# Altium project Master.PrjPcb
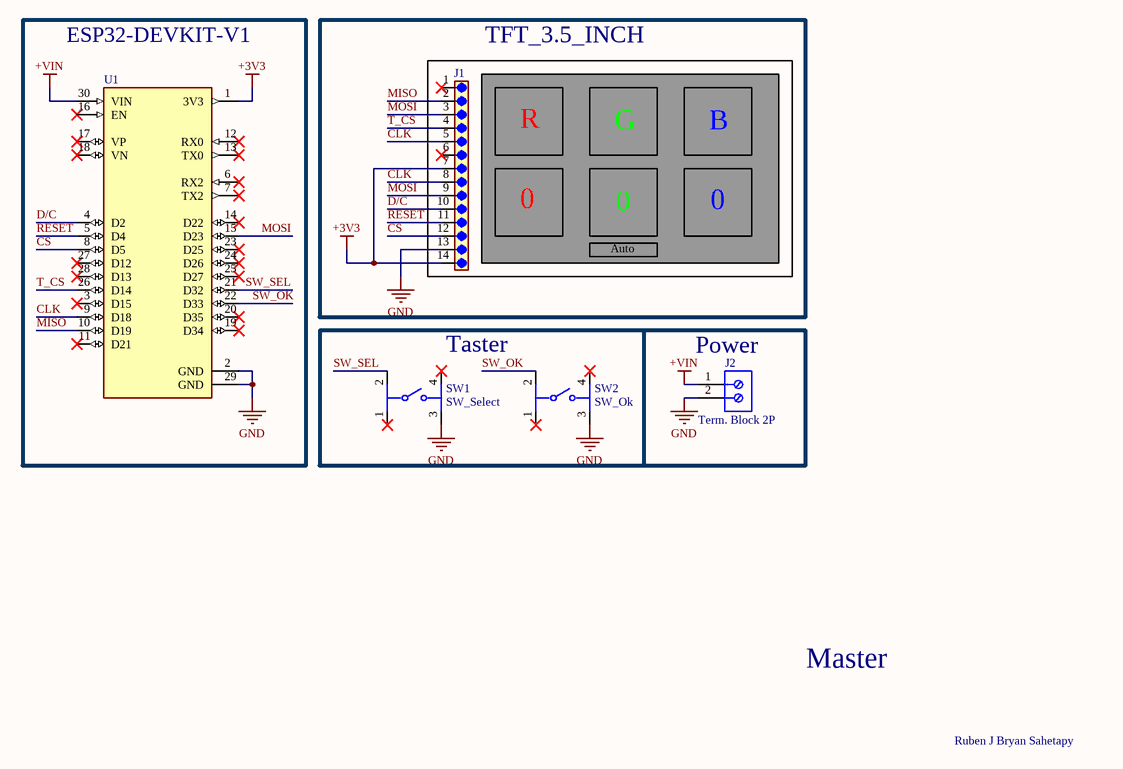
[diagram p0: SCH_Master.SchDoc]
1 sheet, 5 parts. Net scope: global (net labels, ports and power ports of the same name join across sheets).

## Sheet SCH_Master.SchDoc
size A4; SheetNumber: 1; SheetTotal: 1

### Parts
J1  TFT_3.5_INCH  [61301411121]
J2  Term. Block 2P  [691253410002]
SW1  SW_Select  [FP-MJTP1212A-MFG]
SW2  SW_Ok  [FP-MJTP1212A-MFG]
U1  ESP32-DEVKIT-V1  [MODULE_ESP32_DEVKIT_V1]

### Nets
+3V3: J1.7 J1.14 U1.1(3V3)
+VIN: J2.1 U1.30(VIN)
GND: J1.13 J2.2 SW1.3 SW2.3 U1.2(GND) U1.29(GND)
CLK: J1.5 J1.8 U1.9(D18)
CS: J1.12 U1.8(D5)
D/C: J1.10 U1.4(D2)
MISO: J1.2 U1.10(D19)
MOSI: J1.3 J1.9 U1.15(D23)
RESET: J1.11 U1.5(D4)
SW_OK: SW2.2 U1.22(D33)
SW_SEL: SW1.2 U1.21(D32)
T_CS: J1.4 U1.26(D14)

Not connected (* = marked no-connect by the designer): J1 1* 6*; SW1 1* 4*; SW2 1* 4*; U1 3(D15)* 6(RX2)* 7(TX2)* 11(D21)* 12(RX0)* 13(TX0)* 14(D22)* 16(EN)* 17(VP)* 18(VN)* 19(D34)* 20(D35)* 23(D25)* 24(D26)* 25(D27)* 27(D12)* 28(D13)*

### Notes on the sheet
- R
- G
- B
- 0
- Auto
- Taster
- (near J2) Power
- Master
- Ruben J Bryan Sahetapy

### Library data of the parts
J1 = TFT-ILI9488: 3.5-inch TFT LCD (320 × 480) with ILI9488 driver + XPT2046 resistive touch; MF: WÃ¼rth Elektronik; SnapEDA_Link: https://www.snapeda.com/parts/61301411121/W%25C3%25BCrth+Elektronik+Midcom/view-part/?ref=snap; Package: None; Value: 3.5-inch TFT LCD (320 × 480); MP: 61301411121; Check_prices: https://www.snapeda.com/parts/61301411121/W%25C3%25BCrth+Elektronik+Midcom/view-part/?ref=eda; Part Number: TFT-ILI9488; PartID: TFT-ILI9488; TempMin: -30; TempMax: 85; Link: https://grabcad.com/library/3-5-color-spi-display-based-on-ili9488-chip-1
J2 = CMP-1502-02746-3: Terminal Block, 7.62MM Pitch, Horizontal, Rising Cage Clamp, 12-30 AWG, 2 Pin
SW1 SW2 = MJTP1212A: Switch Tactile Button 12x12mm; Contact Resistance: 100mR; Operating Force: 160gf; Max Voltage Rating (DC): 12V; Mechanical Life: 100000Cycles; Actuator Length: 3.5mm; Throw Configuration: SPST; Illumination Type: Non-Illuminated; Actuator Material: Polyoxymethylene; Actuator Type: Standard; Switch Travel: 0.3mm; Current Rating: 50mA; Switch Function: Off-Mom; Value: 0.05A @ 12VDC; Mount: Through Hole; Contact Plating: Silver; Package Quantity: 100; Max Operating Temperature: 70°C; Packaging: Bulk; Voltage Rating (DC): 12V; Termination: PC Pin; Contact Material: Bronze; Orientation: Straight; Min Operating Temperature: -20°C; REACH SVHC: No SVHC; Electrical Life: 100000Cycles; Part Number: MJTP1212A; PartID: MJTP1212A; TempMin: -25; TempMax: 70; Link: https://www.digikey.de/de/products/detail/omron-electronics-inc-emc-div/B3F-4055/31799?gclsrc=aw.ds&gad_source=1&gad_campaignid=19971370784&gbraid=0AAAAADrbLlgb8g5iB56Pq7GBfmlW8M2um&gclid=CjwKCAiA2svIBhB-EiwARWDPjsxJrtH3aqZi4wzUZvXY0ugmwA-CuPqPru_7AumdmvXcQLZq2TM71hoCQyEQAvD_BwE
U1 = ESP32-DEVKIT-V1: ESP32-DEVKIT-V1 30 Pins; Value: Dual Core, Wi-Fi, BLE; MF: Do it; SnapEDA_Link: https://www.snapeda.com/parts/ESP32-DEVKIT-V1/Do+it/view-part/?ref=snap; Package: None; MP: ESP32-DEVKIT-V1; Check_prices: https://www.snapeda.com/parts/ESP32-DEVKIT-V1/Do+it/view-part/?ref=eda; Part Number: ESP32-DEVKIT-V1; PartID: ESP32-DEVKIT-V1; TempMin: -40; TempMax: 85; Link: https://www.snapeda.com/parts/ESP32-DEVKIT-V1/Do+it/view-part/?ref=eda